# Altium schematic sheet Bowler Debug LED.SchDoc: Bowler Server Debug LED
size A; DrawnBy: Adam Vadala-Roth; Engineer: Adam Vadala-Roth; DocumentNumber: 7; Revision: 2.4b; SheetNumber: 7; SheetTotal: 9
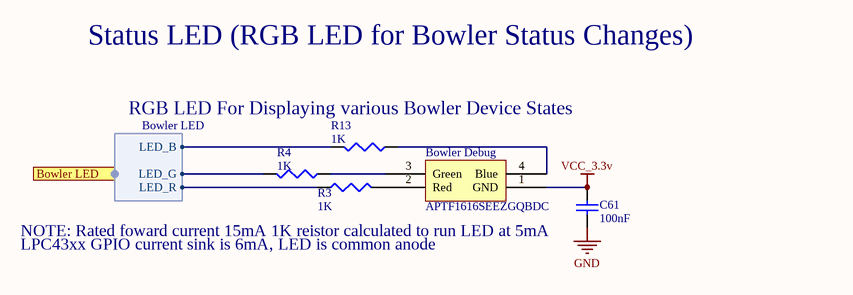
[diagram p0: Bowler Debug LED.SchDoc]

## Parts
Bowler_Debug  APTF1616SEEZGQBDC  [RGB LED APTF1616SEEZGQBDC]
C61  C1: 100nF  [CAPC1608L]  (hidden comment: Cap Semi)
R3  value 1K  [J1-0603]  (hidden comment: Res3)
R4  value 1K  [J1-0603]  (hidden comment: Res3)
R13  value 1K  [J1-0603]  (hidden comment: Res3)

## Ports
Bowler LED (harness Bowler LED)

## Harnesses
Bowler LED: LED_R, LED_G, LED_B

## Nets
GND: C61.1
VCC_3.3v: Bowler_Debug.1(GND) C61.2
NetBowler_Debug_2: Bowler_Debug.2(Red) R3.2
NetBowler_Debug_3: Bowler_Debug.3(Green) R4.1
NetBowler_Debug_4: Bowler_Debug.4(Blue) R13.1
NetR3_1: R3.1 ; port Bowler LED.LED_R
NetR4_2: R4.2 ; port Bowler LED.LED_G
NetR13_2: R13.2 ; port Bowler LED.LED_B

## Notes on the sheet
- Status LED (RGB LED for Bowler Status Changes)
- (near R13) RGB LED For Displaying various Bowler Device States
- (near C61) NOTE: Rated foward current 15mA 1K reistor calculated to run LED at 5mA
- LPC43xx GPIO current sink is 6mA, LED is common anode

## Library data of the parts
Bowler_Debug = RGB LED APTF1616SEEZGQBDC: RGB LED
C61 = Cap Semi: Capacitor (Semiconductor SIM Model); Published: 8-Jun-2000; LatestRevisionDate: 29-May-2009; LatestRevisionNote: IPC-7351 Footprint Added.; PackageReference: C1206; Publisher: Altium Limited; PackageDescription: Chip Capacitor
R3 R4 R13 = Res3: Resistor; Published: 8-Jun-2000; LatestRevisionDate: 29-May-2009; LatestRevisionNote: IPC-7351 Footprint Added.; PackageReference: J1-0603; Publisher: Altium Limited; PackageDescription: Chip Resistor